# Altium schematic sheet 4_Configuration.SchDoc: FPGA Configuration
size Legal; Author: Praveen Perera; DrawnBy: Praveen Perera; Engineer: Praveen Perera; Revision: 0; SheetNumber: 4; SheetTotal: 9; Time: 12/26/2025
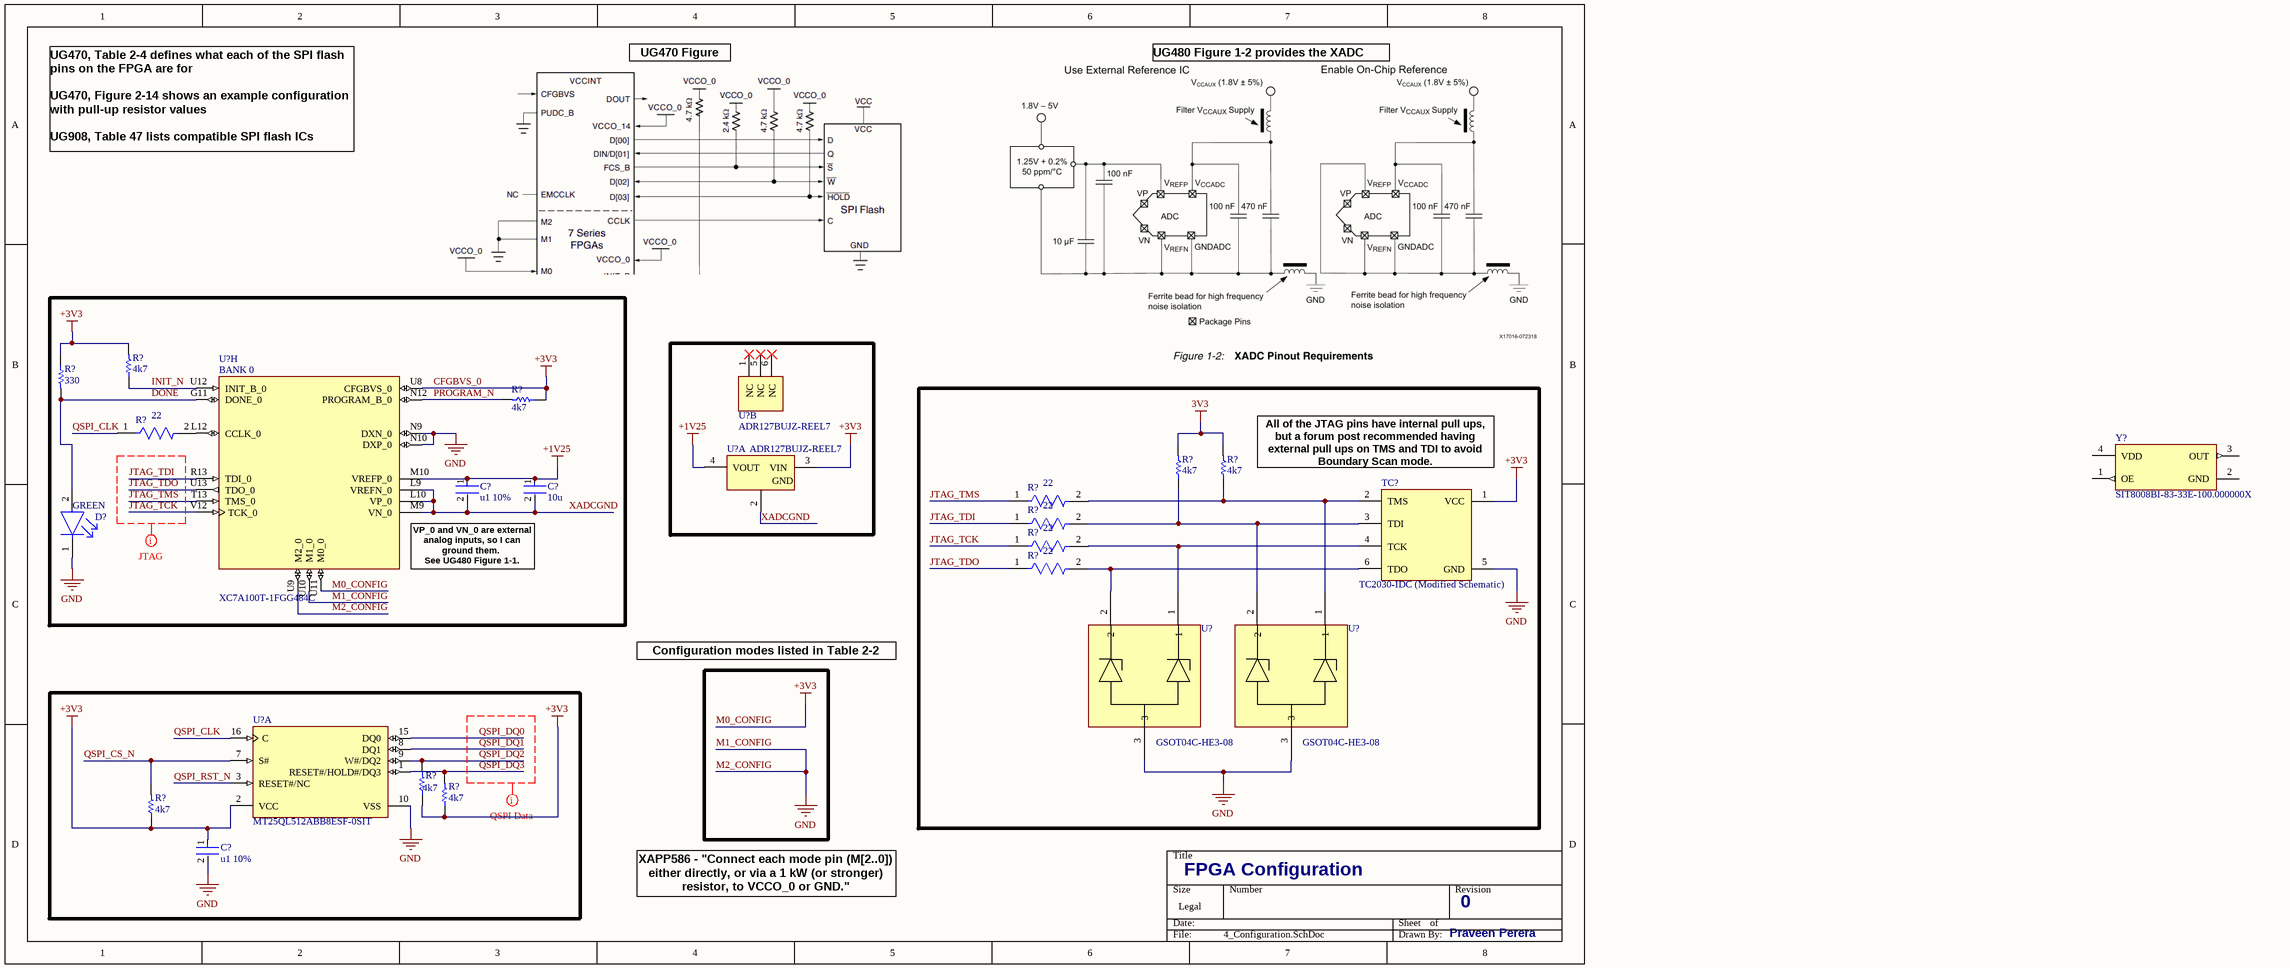
[diagram p0: 4_Configuration.SchDoc]

## Parts
(Parts that share a designator on the sheet are numbered #1, #2 ... from top to bottom, then left to right.)
C?#1  u1 10%  [FP-CL891-IPC_C]
C?#2  10u  [FP-CL05A106MP5NUNC-MFG]
C?#3  u1 10%  [FP-CL891-IPC_C]
D?  GREEN  [FP-SML-D12-MFG]
R?#1  330  [RESC0201(0603)_M]
R?#2  4k7  [RESC0603X28X15NL05T05]
R?#3  4k7  [RESC0603X28X15NL05T05]
R?#4  22  [FP-RMCF0201-IPC_C]
R?#5  4k7  [RESC0603X28X15NL05T05]
R?#6  4k7  [RESC0603X28X15NL05T05]
R?#7  22  [FP-RMCF0201-IPC_C]
R?#8  22  [FP-RMCF0201-IPC_C]
R?#9  22  [FP-RMCF0201-IPC_C]
R?#10  22  [FP-RMCF0201-IPC_C]
R?#11  4k7  [RESC0603X28X15NL05T05]
R?#12  4k7  [RESC0603X28X15NL05T05]
R?#13  4k7  [RESC0603X28X15NL05T05]
TC?  TC2030-IDC (Modified Schematic)  [*TC2030-IDC]
U?#1  ADR127BUJZ-REEL7  [ADI-UJ-6_M]  (part B of 2)
U?#2  ADR127BUJZ-REEL7  [ADI-UJ-6_M]  (part A of 2)
U?#3  XC7A100T-1FGG484C  [BGA484C100P22X22_2300X2300X260N]  (part H of 14)
U?#4  GSOT04C-HE3-08  [SOT_C-HE3-08_VIS]
U?#5  GSOT04C-HE3-08  [SOT_C-HE3-08_VIS]
U?#6  MT25QL512ABB8ESF-0SIT  [MICT-SF-16_L]  (part A of 2)
Y?  SIT8008BI-83-33E-100.000000X  [FP-SiT8008-8-MFG]

## Nets
3V3: R?#5.2 R?#6.2
+1V25: C?#1.1 C?#2.1 U?#2.4(VOUT) U?#3.M10(VREFP_0)
CFGBVS_0: C?#3.1 R?#1.1 R?#2.2 R?#3.1 R?#11.1 R?#12.1 R?#13.1 TC?.1(VCC) U?#2.3(VIN) U?#3.U8(CFGBVS_0) U?#3.U11(M0_0) U?#6.2(VCC)  [also labelled +3V3, M0_CONFIG]
M1_CONFIG: C?#3.2 D?.1(C) TC?.5(GND) U?#3.N9(DXN_0) U?#3.N10(DXP_0) U?#3.U9(M2_0) U?#3.U10(M1_0) U?#4.3 U?#5.3 U?#6.10(VSS)  [also labelled GND, M2_CONFIG]
DONE: D?.2(A) R?#1.2 U?#3.G11(DONE_0)
INIT_N: R?#2.1 U?#3.U12(INIT_B_0)
JTAG_TCK: R?#9.1 U?#3.V12(TCK_0)
JTAG_TDI: R?#8.1 U?#3.R13(TDI_0)
JTAG_TDO: R?#10.1 U?#3.U13(TDO_0)
JTAG_TMS: R?#7.1 U?#3.T13(TMS_0)
PROGRAM_N: R?#3.2 U?#3.N12(PROGRAM_B_0)
QSPI_CLK: R?#4.1 U?#6.16(C)
QSPI_CS_N: R?#13.2 U?#6.7(S#)
QSPI_DQ0: U?#6.15(DQ0)
QSPI_DQ1: U?#6.8(DQ1)
QSPI_DQ2: R?#11.2 U?#6.9(W#/DQ2)
QSPI_DQ3: R?#12.2 U?#6.1(RESET#/HOLD#/DQ3)
QSPI_RST_N: U?#6.3(RESET#/NC)
XADCGND: C?#1.2 C?#2.2 U?#2.2(GND) U?#3.L9(VREFN_0) U?#3.L10(VP_0) U?#3.M9(VN_0)
NetR?#4_2: R?#4.2 U?#3.L12(CCLK_0)
NetR?#5_1: R?#5.1 R?#8.2 TC?.3(TDI) U?#5.2
NetR?#6_1: R?#6.1 R?#7.2 TC?.2(TMS) U?#5.1
NetR?#9_2: R?#9.2 TC?.4(TCK) U?#4.1
NetR?#10_2: R?#10.2 TC?.6(TDO) U?#4.2

Not connected (* = marked no-connect by the designer): U?#1 1(NC)* 5(NC)* 6(NC)*; Y? 1(OE) 2(GND) 3(OUT) 4(VDD)

## Layout directives
mark named JTAG: JTAG_TCK, JTAG_TDI, JTAG_TDO, JTAG_TMS
mark named QSPI Data: QSPI_DQ0, QSPI_DQ1, QSPI_DQ2, QSPI_DQ3

## Notes on the sheet
- UG470 Figure 2-14
- UG480 Figure 1-2 provides the XADC pinout
- UG470, Table 2-4 defines what each of the SPI flash pins on the FPGA are for
  UG470, Figure 2-14 shows an example configuration with pull-up resistor values
  UG908, Table 47 lists compatible SPI flash ICs
- All of the JTAG pins have internal pull ups, but a forum post recommended having external pull ups on TMS and TDI to avoid Boundary Scan mode.
- (near U?#3) VP_0 and VN_0 are external analog inputs, so I can ground them.
  See UG480 Figure 1-1.
- Configuration modes listed in Table 2-2 UG470
- XAPP586 - "Connect each mode pin (M[2..0]) either directly, or via a 1 kW (or stronger) resistor, to VCCO_0 or GND."
- (in symbol XC7A100T-1FGG484C, part H) BANK 0

## Library data of the parts
C?#1 C?#3 = CMP-13271-001945-1: CL05B104KB5NNNC / Cap Ceramic 100nF 50V X7R ±10% SMD 0402 +125°C Paper T/R
C?#2 = CMP-13271-000002-1: CL05A106MP5NUNC / CAP CER 10UF 10V X5R 0402; Manufacturer: Samsung; Temperature Coefficient: 15%; Tolerance: 20%; Material: Ceramic; Octopart: https://octopart.com/cl05a106mp5nunc-samsung-22457395; Voltage Rating: 10V; RoHS: TRUE; Value: 10uF; Height: 0.7mm; Digikey Description: CAP CER 10UF 10V X5R 0402; Automotive: No; Package: CL05A106MP5NUNC; Device Class L1: Passive Components; Capacitance: 10uF; Temperature Range High: +85°C; ComponentLink2Description: Datasheet; Device Class L2: Capacitors; Temperature Characteristic: X5R; Manufacturer Part Number: CL05A106MP5NUNC; Temperature: -55°C to +85°C; ComponentLink2URL: http://www.samsungsem.com/kr/support/product-search/mlcc/__icsFiles/afieldfile/2019/05/10/19-CL05A106MP5NUNC.pdf; Device Class L3: Ceramic Capacitors; Category: Cap; Temperature Range Low: -55°C; Ipc Land Pattern Name: CAPC10050X50; Lead Free: Yes
D? = CMP-08952-000005-1: SML-D12M1WT86 / LED YLW/GREEN DIFFUSED 1608 SMD; Manufacturer: Rohm; Led Orientation: Top View; Forward Voltage: 2.2V; Power Dissipation: 54mW; Wavelength: 572nm; Reverse Voltage: 5V; Forward Current: 20mA; Luminous Intensity: 30mcd; Manufacturer Part Number: SML-D12M1WT86; RoHS: TRUE; Package: SML-D12; Temperature Range Low: -40°C; Device Class L3: unset; Temperature Range High: +85°C; Device Class L2: LEDs; Category: Diode; Device Class L1: Optoelectronics; Digikey Description: LED YLW/GREEN DIFFUSED 1608 SMD; Temperature: -40°C to +85°C; ComponentLink2Description: Datasheet; Colour: Green; Automotive: No; Height: 0.65mm; Lead Free: Yes; Octopart: https://octopart.com/sml-d12m1wt86-rohm-70837112; ComponentLink2URL: https://www.rohm.com/datasheet/SML-D12M1W
R?#1 = CMP-1010-00062-1: 330R 0.05W 5% 0201 (0603 Metric)  SMD; Case-EIA: 0201; Value: 330.00 Ohm; Case-Metric: 0603; Tolerance: 5 %; Technology: SMT; Power: 0.05 W
R?#2 R?#3 R?#5 R?#6 R?#11-R?#13 = CMP-2004-00672-1: CRCW02014K70FNED; Manufacturer: Vishay Dale; Part Number: CRCW02014K70FNED
R?#4 R?#7-R?#10 = CMP-26527-003623-1: RMCF0201JG22R0 / 22Ω ±5% 0.05W 0201 Thick Film Chip Resistor AEC-Q200 compliant; Max Power Dissipation: 50mW; Resistance: 22R; Temperature Coefficient: 200ppm/°C; Length: 0.024inch; Height: 0.009inch; Max Operating Temperature: 125°C; Packaging: Tape and Reel; Number of Terminations: 2; Case/Package: 0201; Resistor Type: Thick Film; Width: 0.012inch; Case Code (Metric): 0603; Min Operating Temperature: -55°C; Case Code (Imperial): 0201; Tolerance: 5%
TC? = CMP-022-000000-2: PLUG-OF-NAILS 6-PIN W/ LEGS 8; MF: Tag-Connect LLC; MP: TC2030-IDC; Component Type: Standard; Source: TC2030-IDC Modified.SchLib; Pin Count: 6; Value: *; SnapEDA_Link: https://www.snapeda.com/parts/TC2030-IDC/Tag-Connect/view-part/?ref=snap; Package: None; Design Item ID: TC2030-IDC; Check_prices: https://www.snapeda.com/parts/TC2030-IDC/Tag-Connect/view-part/?ref=eda
U?#1 U?#2 = CMP-0784-00537-1: Precision, Micropower LDO Voltage Reference in TSOT, 1.25 V Output, 2.7 to 18 V Supply, Industrial, 6-pin SOT23 (UJ-6), Reel; Manufacturer: Analog Devices; Max V Supply (V): 18; Vout: 1.25V; Ref Out TC (ppm/C): 3; Min V Supply (V): 2.7; ComponentLink1URL: http://www.analog.com/en/index.html; PartNumber: ADR127BUJZ-REEL7; Operating Temp Range: -40 to 125 degC; ComponentLink4URL: Product URL:http://www.analog.com/en/special-linear-functions/voltage-references/adr127/products/product.html; ComponentLink1Description: Manufacturer URL; Code_JEDEC: MO-193-AA; Packing: Reel; ComponentLink3Description: Package Specification; ComponentLink2URL: http://www.analog.com/static/imported-files/data_sheets/ADR121_125_127.pdf; ComponentLink2Description: Datasheet; DatasheetVersion: Rev. B; Mounting Technology: Surface Mount; PackageReference: UJ-6; PackageDescription: 6-Pin Thin Small Outline Transistor Package, Body 2.9 x 1.6 mm, Pitch 0.95 mm; ComponentLink3URL: http://www.analog.com/static/imported-files/packages/PKG_PDF/TSOT(UJ)/UJ_6.pdf; ComponentLink4Description: URL Link1; PackageVersion: Dec-04
U?#3 = XC7A100T-1FGG484C: Artix-7 Field Programmable Gate Array (FPGA) IC 285 4976640 101440 484-BBGA; MF: Xilinx Inc.; Value: *; Check_prices: https://www.snapeda.com/parts/XC7A100T-1FGG484C/Xilinx/view-part/?ref=eda; MP: XC7A100T-1FGG484C; SnapEDA_Link: https://www.snapeda.com/parts/XC7A100T-1FGG484C/Xilinx/view-part/?ref=snap; Package: FBGA-484 Xilinx
U?#4 U?#5 = GSOT04C-HE3-08: ESD PROTECTION DIODE SOT23; Manufacturer_Name: Vishay; Type: Type; Datasheet: https://www.vishay.com/doc?85824; Manufacturer_Part_Number: GSOT04C-HE3-08; Copyright: Copyright (C) 2025 Ultra Librarian. All rights reserved.; RefDes: RefDes
U?#6 = CMP-2000-07603-1: Micron Serial NOR Flash Memory, 512 Mbits, 2.7 to 3.6 V, -40 to 85 degC, 16-Pin SOP2 (SF), RoHS; Operating Supply Voltage: 3V; Min Supply Voltage: 2.7V; Page Size: 256B; Access Time: 6ns; Max Supply Voltage: 3.6V; Frequency: 133MHz; Density: 512Mb; Datasheet URL: https://www.micron.com/~/media/documents/products/data-sheet/nor-flash/serial-nor/mt25q/die-rev-b/mt25q_qlkt_l_512_abb_0.pdf; Mounting Technology: SurfaceMount; Min Operating Temperature: -40degC; Package Reference: SF-16; Mount: SurfaceMount; Package Description: 16-Pin Small Outline Integrated Circuit Wide, Body 7.5 X 10.3 mm, Pitch 1.27 mm; Interface: Serial; Memory Type: FLASH; Datasheet Version: Rev. E, 06/2017; Manufacturer URL: http://www.micron.com/; RoHSCompliant: True; Manufacturer: Micron; Max Operating Temperature: 85degC
Y? = CMP-25159-260204-1: MEMS OSC XO 100.0000MHZ H/LVCMOS; Frequency Stability: 50ppm; Frequency: 100MHz; Max Supply Current: 4.5mA; Width: 0.197inch; Height: 0.039inch; Packaging: Cut Tape; Max Operating Temperature: 85°C; RoHS Compliant: Yes; Length: 0.276inch; Case/Package: SMD/SMT; Mount: Surface Mount; Series: SIT8008; Min Operating Temperature: -40°C